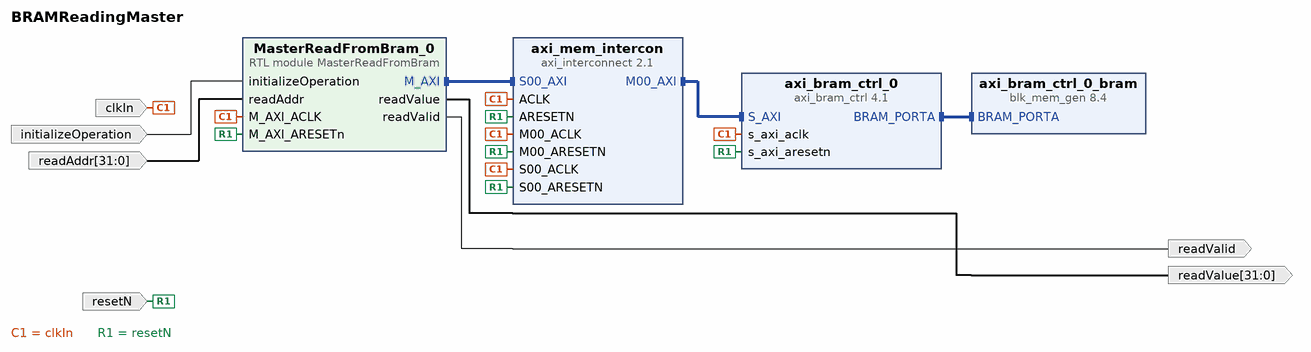
[diagram p0: block diagram of the top level]
# Vivado block design BRAMReadingMaster, xc7z010clg400-1, Vivado 2019.1
create_bd_design BRAMReadingMaster

create_bd_port -dir O -from 31 -to 0 readValue
create_bd_port -dir O readValid
create_bd_port -dir I initializeOperation
create_bd_port -dir I -from 31 -to 0 readAddr
create_bd_port -dir I clkIn
create_bd_port -dir I resetN

create_bd_cell -type ip -vlnv xilinx.com:ip:axi_bram_ctrl:4.1 axi_bram_ctrl_0
set_property -dict {CONFIG.PROTOCOL AXI4LITE CONFIG.SINGLE_PORT_BRAM 1} [get_bd_cells axi_bram_ctrl_0]
create_bd_cell -type ip -vlnv xilinx.com:ip:blk_mem_gen:8.4 axi_bram_ctrl_0_bram
set_property -dict [list \
  CONFIG.Coe_File ../../../../../../../../MemFiles/SampleMemFile.coe \
  CONFIG.Load_Init_File true \
  CONFIG.Memory_Type Single_Port_ROM \
  CONFIG.Port_A_Write_Rate 0 \
] [get_bd_cells axi_bram_ctrl_0_bram]
create_bd_cell -type ip -vlnv xilinx.com:ip:axi_interconnect:2.1 axi_mem_intercon
set_property -dict {CONFIG.NUM_MI 1} [get_bd_cells axi_mem_intercon]
create_bd_cell -type module -reference MasterReadFromBram MasterReadFromBram_0

# ---- connections ----

connect_bd_intf_net [get_bd_intf_pins axi_mem_intercon/M00_AXI] [get_bd_intf_pins axi_bram_ctrl_0/S_AXI]
connect_bd_intf_net [get_bd_intf_pins axi_bram_ctrl_0_bram/BRAM_PORTA] [get_bd_intf_pins axi_bram_ctrl_0/BRAM_PORTA]
connect_bd_intf_net [get_bd_intf_pins MasterReadFromBram_0/M_AXI] [get_bd_intf_pins axi_mem_intercon/S00_AXI]
connect_bd_net -net clk_wiz_clk_out1 [get_bd_ports clkIn] \
  [get_bd_pins axi_mem_intercon/S00_ACLK] [get_bd_pins axi_bram_ctrl_0/s_axi_aclk] [get_bd_pins axi_mem_intercon/M00_ACLK] \
  [get_bd_pins axi_mem_intercon/ACLK] [get_bd_pins MasterReadFromBram_0/M_AXI_ACLK]
connect_bd_net -net rst_clk_wiz_100M_peripheral_aresetn [get_bd_ports resetN] \
  [get_bd_pins axi_mem_intercon/S00_ARESETN] [get_bd_pins axi_bram_ctrl_0/s_axi_aresetn] \
  [get_bd_pins axi_mem_intercon/M00_ARESETN] [get_bd_pins axi_mem_intercon/ARESETN] \
  [get_bd_pins MasterReadFromBram_0/M_AXI_ARESETn]
connect_bd_net [get_bd_pins MasterReadFromBram_0/readValue] [get_bd_ports readValue]
connect_bd_net [get_bd_pins MasterReadFromBram_0/readValid] [get_bd_ports readValid]
connect_bd_net [get_bd_ports initializeOperation] [get_bd_pins MasterReadFromBram_0/initializeOperation]
connect_bd_net [get_bd_ports readAddr] [get_bd_pins MasterReadFromBram_0/readAddr]

# ---- address map ----
assign_bd_address -offset 0xC0000000 -range 8K -target_address_space [get_bd_addr_spaces MasterReadFromBram_0/M_AXI] [get_bd_addr_segs axi_bram_ctrl_0/S_AXI/Mem0]

validate_bd_design
save_bd_design
